# EAGLE design TMP102_Breakout-v12 (EAGLE 6.4)
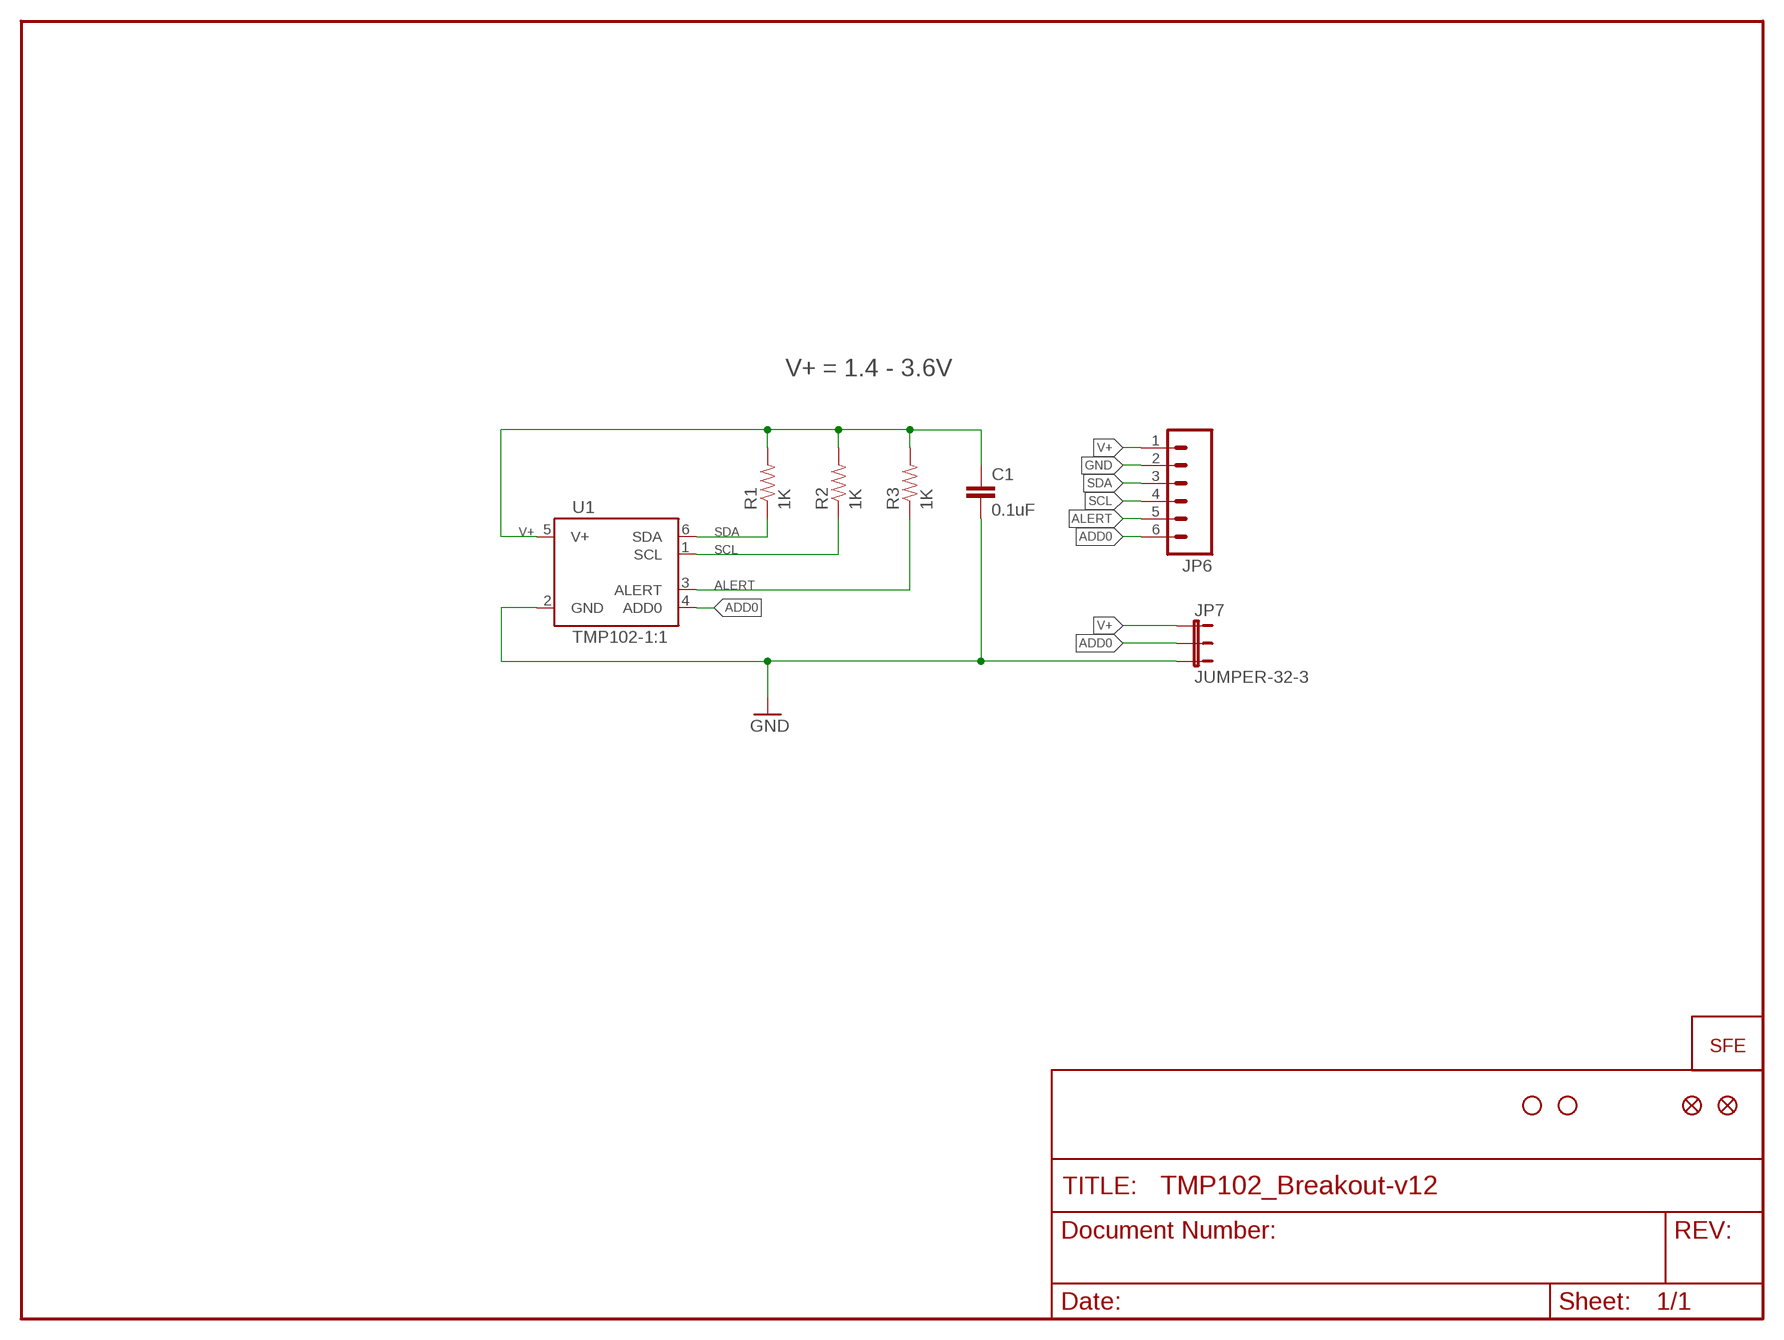
[diagram p0: schematic, sheet 1]

## Parts
C1  0.1uF  CAP0603-CAP  [0603-CAP]
JP1  STAND-OFFTIGHT  [STAND-OFF-TIGHT]
JP2  STAND-OFFTIGHT  [STAND-OFF-TIGHT]
JP3  LOGO-SFESK  [SFE-LOGO-FLAME]
JP4  FIDUCIAL1X2  [FIDUCIAL-1X2]
JP5  FIDUCIAL1X2  [FIDUCIAL-1X2]
JP6  M06SIP  [1X06]
JP7  JUMPER-32-3  [SJ_3_PASTE2&3]
R1  1K  RESISTOR0603-RES  [0603-RES]
R2  1K  RESISTOR0603-RES  [0603-RES]
R3  1K  RESISTOR0603-RES  [0603-RES]
U1  TMP102-1:1  [SOT563-2]

## Nets
ADD0: JP6.6 JP7.2 U1.4(ADD0)
ALERT: JP6.5 R3.1 U1.3(ALERT)
GND: C1.2 JP6.2 JP7.3 U1.2(GND)
SCL: JP6.4 R2.1 U1.1(SCL)
SDA: JP6.3 R1.1 U1.6(SDA)
V+: C1.1 JP6.1 JP7.1 R1.2 R2.2 R3.2 U1.5(V+)

## Notes on the sheet
- V+ = 1.4 - 3.6V

## Library data of the parts
C1 = SparkFun:CAP: Capacitor Standard 0603 ceramic capacitor, and 0.1" leaded capacitor.
JP1 JP2 = SparkFun:STAND-OFF: Stand Off This is the mechanical footprint for a #4 phillips button head screw. Use the keepout ring to avoid running the screw head into surrounding components. SKU : PRT-00447
JP3 = SparkFun:LOGO-SFE: Spark Fun Electronics PCB Logo This is the standard Spark Fun Electronics PCB logo.
JP4 JP5 = SparkFun:FIDUCIAL: Fiducial Alignment Points Various fiducial points for machine vision alignment.
JP6 = SparkFun:M06: Header 6 Standard 6-pin 0.1" header. Use with straight break away headers (SKU : PRT-00116), right angle break away headers (PRT-00553), swiss pins (PRT-00743), machine pins (PRT-00117), and female headers (PRT-00115). Molex polarized connector foot print use with SKU : PRT-08094 with associated crimp pins and housings. NOTES ON THE VARIANTS LOCK and LOCK_LONGPADS... This footprint was designed to help hold the alignment of a through-hole component (i.e. 6-pin header) while soldering it into place. You may notice that each hole has been shifted either up or down by 0.005 of an inch from it's more standard position (which is a perfectly straight line). This slight alteration caused the pins (the squares in the middle) to touch the edges of the holes. Because they are alternating, it causes a "brace" to hold the component in place. 0.005 has proven to be the perfect amount of "off-center" position when using our standard breakaway headers. Although looks a little odd when you look at the bare footprint, once you have a header in there, the alteration is very hard to notice. Also, if you push a header all the way into place, it is covered up entirely on the bottom side. This idea of altering the position of holes to aid alignment will be further integrated into the Sparkfun Library for other footprints. It can help hold any component with 3 or more connection pins.
JP7 = SparkFun:JUMPER-3
R1-R3 = SparkFun:RESISTOR: Resistor Basic schematic elements and footprints for 0603, 1206, and PTH resistors.
U1 = SparkFun:TMP102

## Board
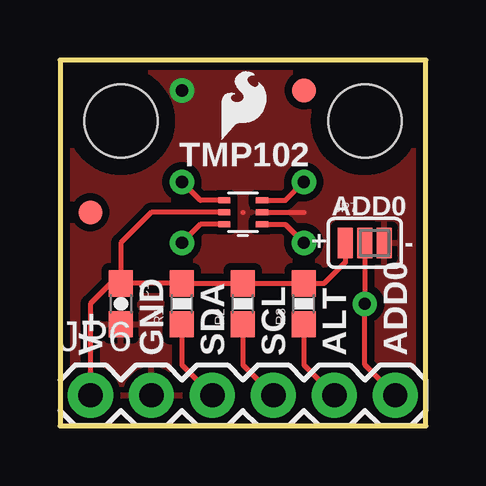
[diagram p1: board, top side]
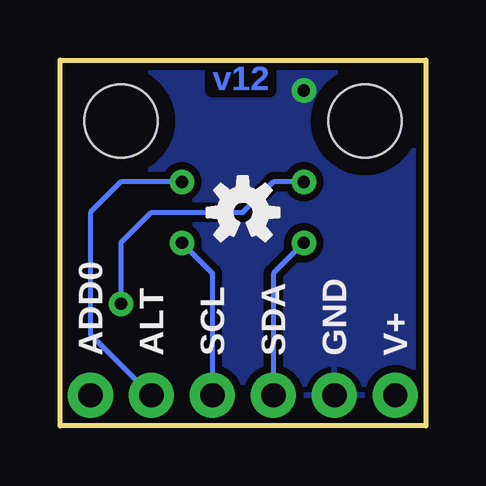
[diagram p2: board, bottom side, seen from below]

Size 15.24 x 15.24 mm. Coordinates in mm from the lower left corner, seen from the top.
Outline: 0,0 15.24,0 15.24,15.24 0,15.24 0,0
Copper layers (1*16): Top 0.035mm / dielectric 1.5mm / Bottom 0.035mm
Design rules "SparkFun": minimum track width 7mil, minimum drill 15mil, track to track 8mil, track to pad 8mil, pad to pad 8mil, via to via 8mil, smd to smd 8mil, copper to edge 8mil, drill to drill 8mil, minimum pad ring 12mil, minimum via ring 10mil, stop-mask expansion 4mil, vias tented up to drill 20mil, thermal gap 10mil

### Footprints (pad centres in the part's own frame; a part is rotated, then mirrored left to right if it is on the bottom)
0603-CAP = smd 1.1 x 1: 1 -0.85,0; 2 0.85,0
STAND-OFF-TIGHT = hole 3.048: 0,0
FIDUCIAL-1X2 = smd 1 x 1: 1 0,0
1X06 = drill 1.016 pad 1.88: 1 0,0; 2 2.54,0; 3 5.08,0; 4 7.62,0; 5 10.16,0; 6 12.7,0
SJ_3_PASTE2&3 = smd 0.635 x 1.27: 1 -0.813,0; 2 0,0; 3 0.813,0
0603-RES = smd 1.1 x 1: 1 -0.85,0; 2 0.85,0
SOT563-2 = smd 0.508 x 0.249: 1 -0.8,0.498; 2 -0.8,0.003; 3 -0.8,-0.506; 4 0.776,-0.506; 5 0.776,0.003; 6 0.776,0.498

### Placement (x,y rotation side)
C1  2.54,5.08 270 top
JP1  2.54,12.7 0 top
JP2  12.7,12.7 0 top
JP3  6.73,11.94 0 top
JP4  1.27,8.89 0 top
JP5  10.16,13.97 0 top
JP6  1.27,1.27 0 top
JP7  12.7,7.62 0 top
R1  5.08,5.08 90 top
R2  7.62,5.08 90 top
R3  10.16,5.08 90 top
U1  7.62,8.89 180 top
U$1  [OSHW-LOGO-S]  7.62,8.89 0 bottom

### Tracks (layer width: path | path; a pad name or v marks a point on that pad's centre or on a via)
ADD0  (via drill 0.51)
  Top 0.203: JP6.6 12.7,2.54 v12.7,5.08 JP7.2 | U1.4 5.84,9.4 v5.08,10.16
  Bottom 0.203: v5.08,10.16 6.35,10.16 7.62,8.89 11.43,8.89 JP7.2 v12.7,5.08
ALERT  (via drill 0.51)
  Top 0.203: R3.1 10.16,2.54 JP6.5 | U1.3 9.4,9.4 v10.16,10.16
  Bottom 0.203: v10.16,10.16 12.7,10.16 13.97,8.89 13.97,3.81 JP6.5
GND  (via drill 0.51)
  Top 0.203: 7.62,8.89 | U1.2 10.16,8.89
  other vias: 5.08,13.97
  pour Bottom (isolate 0.305): 0,15.24 15.24,15.24 15.24,0 0,0
  pour Top (isolate 0.305): 0,15.24 15.24,15.24 15.24,0 0,0
SCL  (via drill 0.51)
  Top 0.203: R2.1 7.62,2.54 JP6.4 | U1.1 9.39,8.39 v10.16,7.62
  Bottom 0.203: v10.16,7.62 8.89,6.35 JP6.4
SDA  (via drill 0.51)
  Top 0.203: R1.1 5.08,2.54 JP6.3 | U1.6 5.85,8.39 v5.08,7.62
  Bottom 0.203: v5.08,7.62 6.35,6.35 JP6.3
V+
  Top 0.203: JP6.1 1.27,5.08 2.12,5.93 C1.1 | C1.1 R1.2 R2.2 R3.2 11.01,5.93 11.89,6.81 JP7.1 | U1.5 3.81,8.89 2.54,7.62 C1.1

### Text on the board
Bottom: v12
tPlace: TMP102 | ADD0 | + | - | V+ | GND | SDA | SCL | ALT | ADD0
bPlace: V+ | GND | SDA | SCL | ALT | ADD0